# EAGLE design eCog_General_Template (EAGLE 6.6.0)
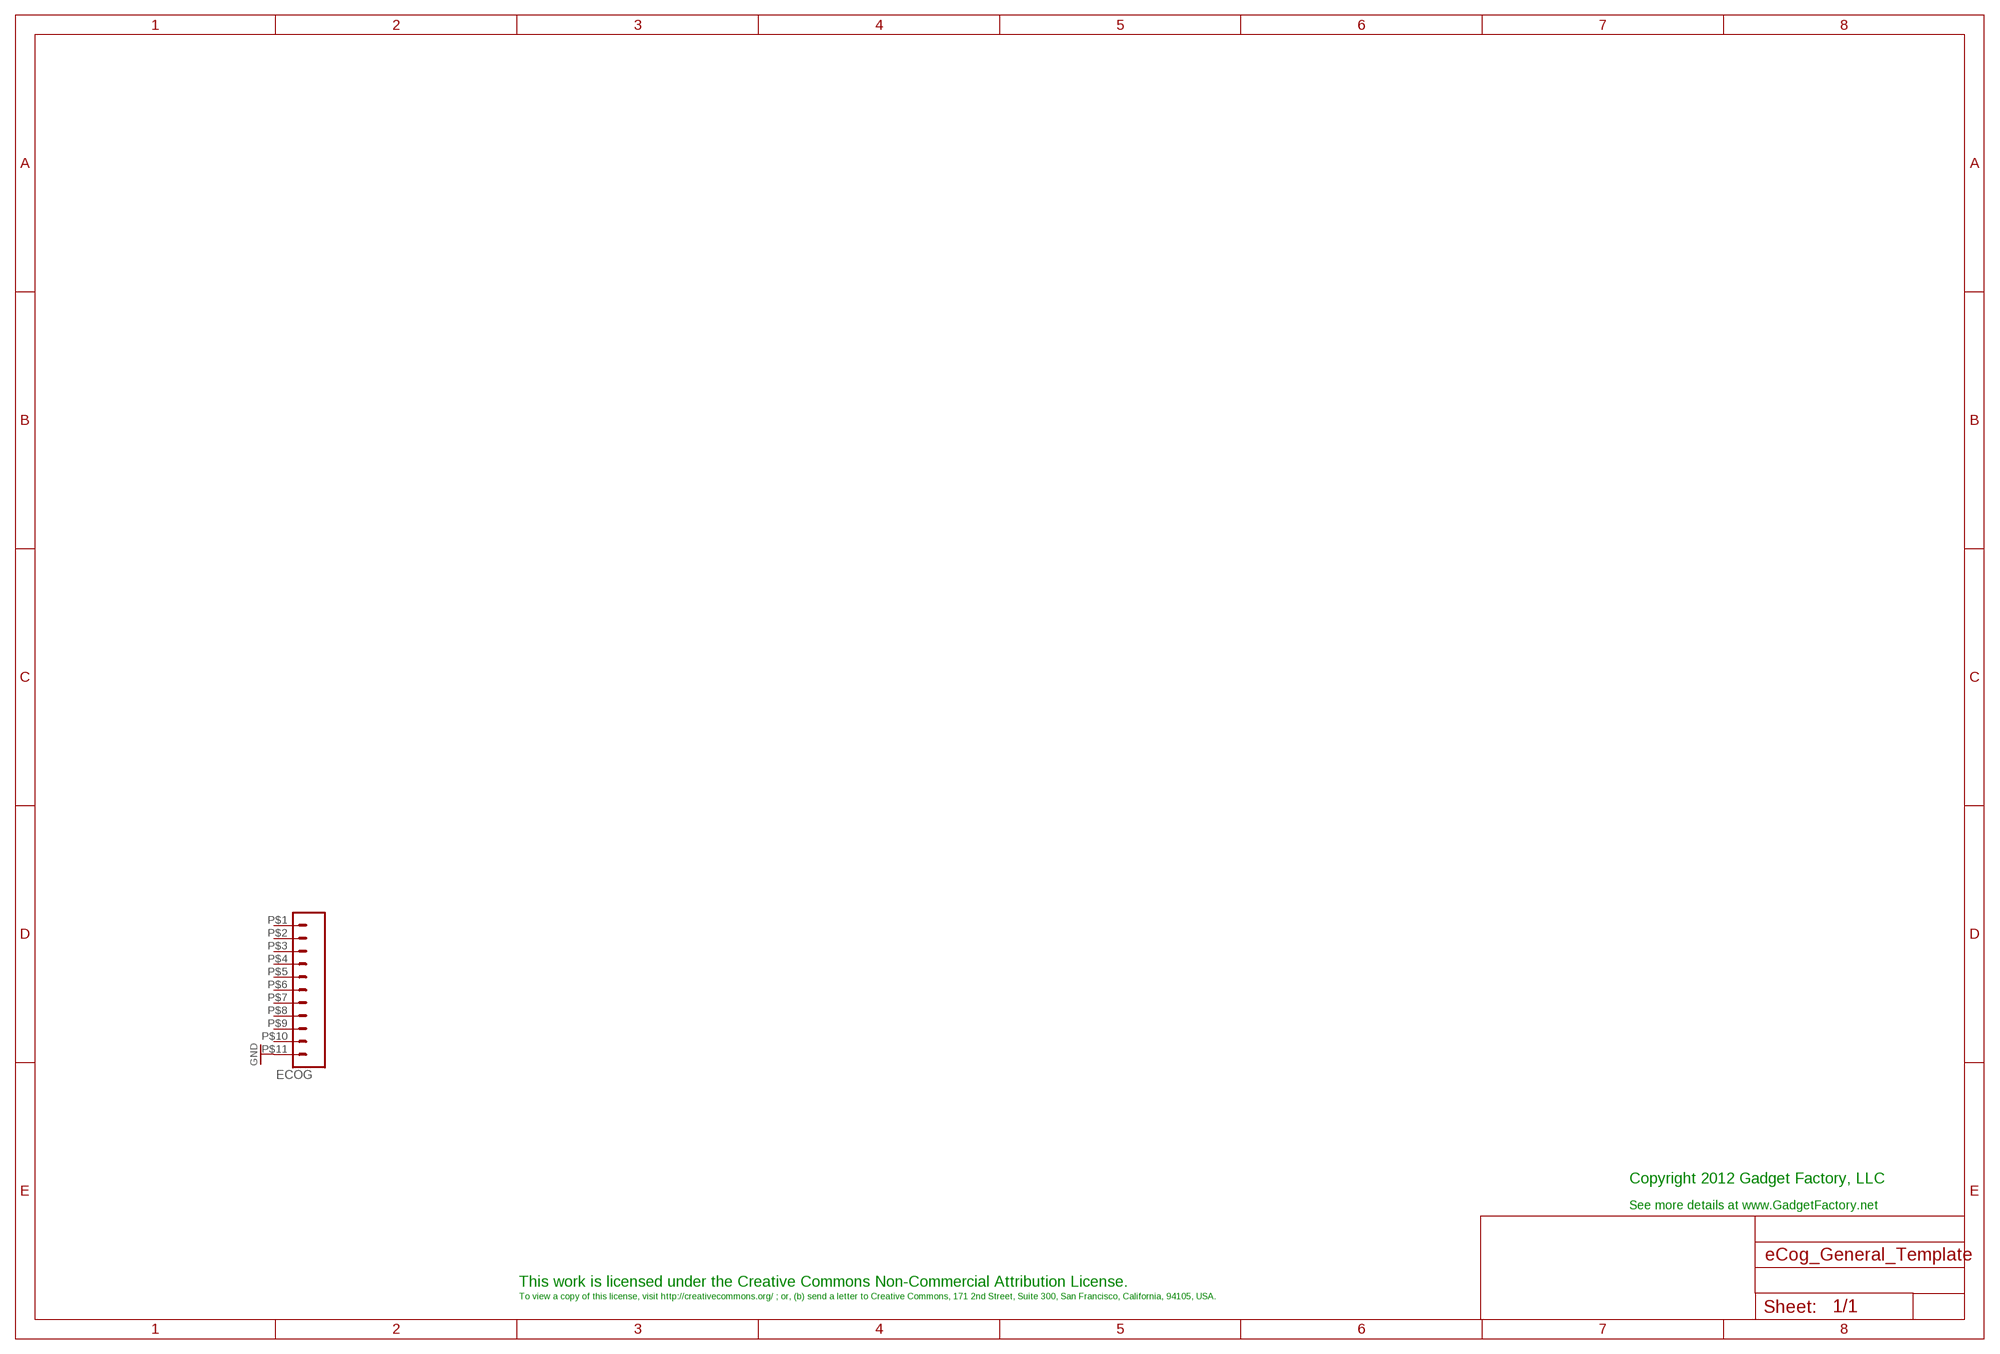
[diagram p0: schematic, sheet 1]

## Parts
ECOG  ECOG_GENERAL_ROWECOG_GENERAL_SMD  [ECOG_GENERAL_SMD]

## Nets
GND: ECOG.P$11(GND)
Unconnected: ECOG.P$1(G0) ECOG.P$2(G1) ECOG.P$3(G2) ECOG.P$4(G3) ECOG.P$5(G4) ECOG.P$6(G5) ECOG.P$7(G6) ECOG.P$8(5V) ECOG.P$9(3V3) ECOG.P$10(G7)

## Notes on the sheet
- Copyright 2012 Gadget Factory, LLC
- See more details at www.GadgetFactory.net
- This work is licensed under the Creative Commons Non-Commercial Attribution License.
- To view a copy of this license, visit http://creativecommons.org/ ; or, (b) send a letter to Creative Commons, 171 2nd Street, Suite 300, San Francisco, California, 94105, USA.

## Library data of the parts
ECOG = eCogs:ECOG_GENERAL_ROW

## Board
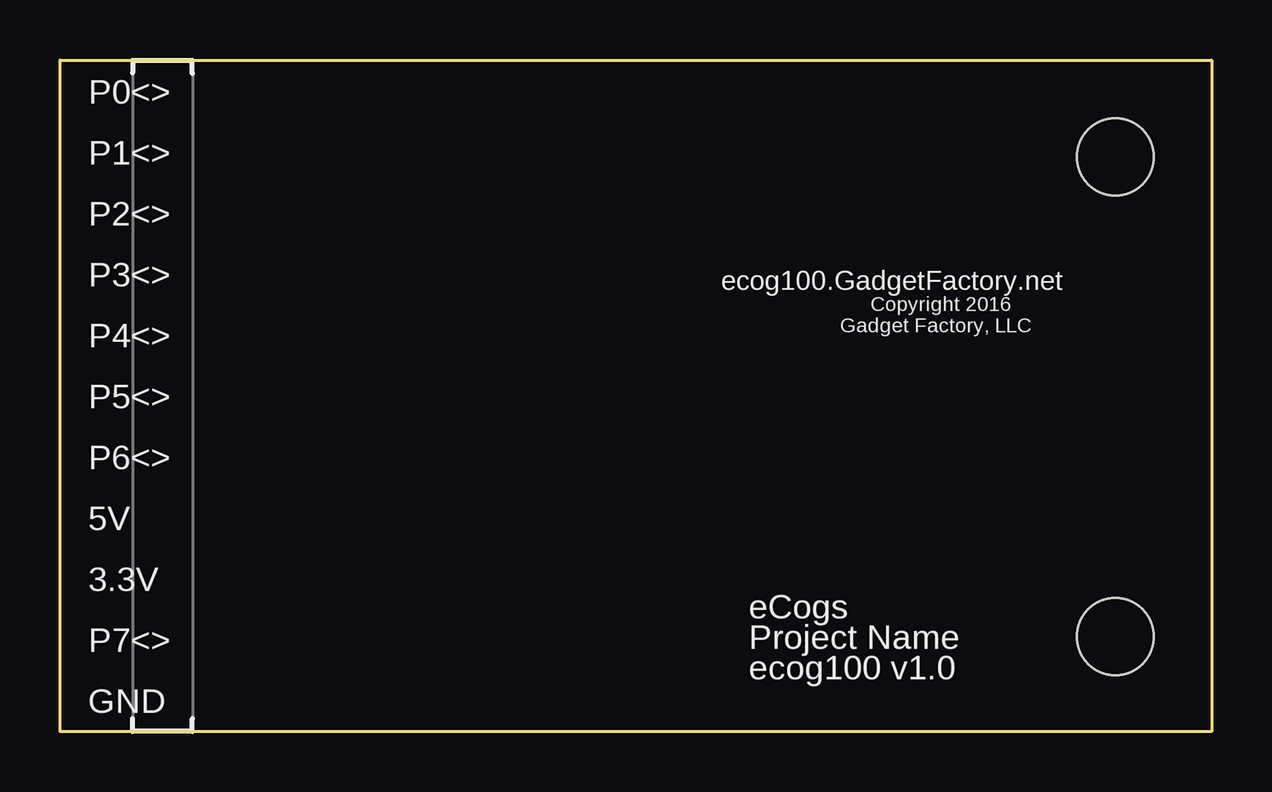
[diagram p1: board, top side]
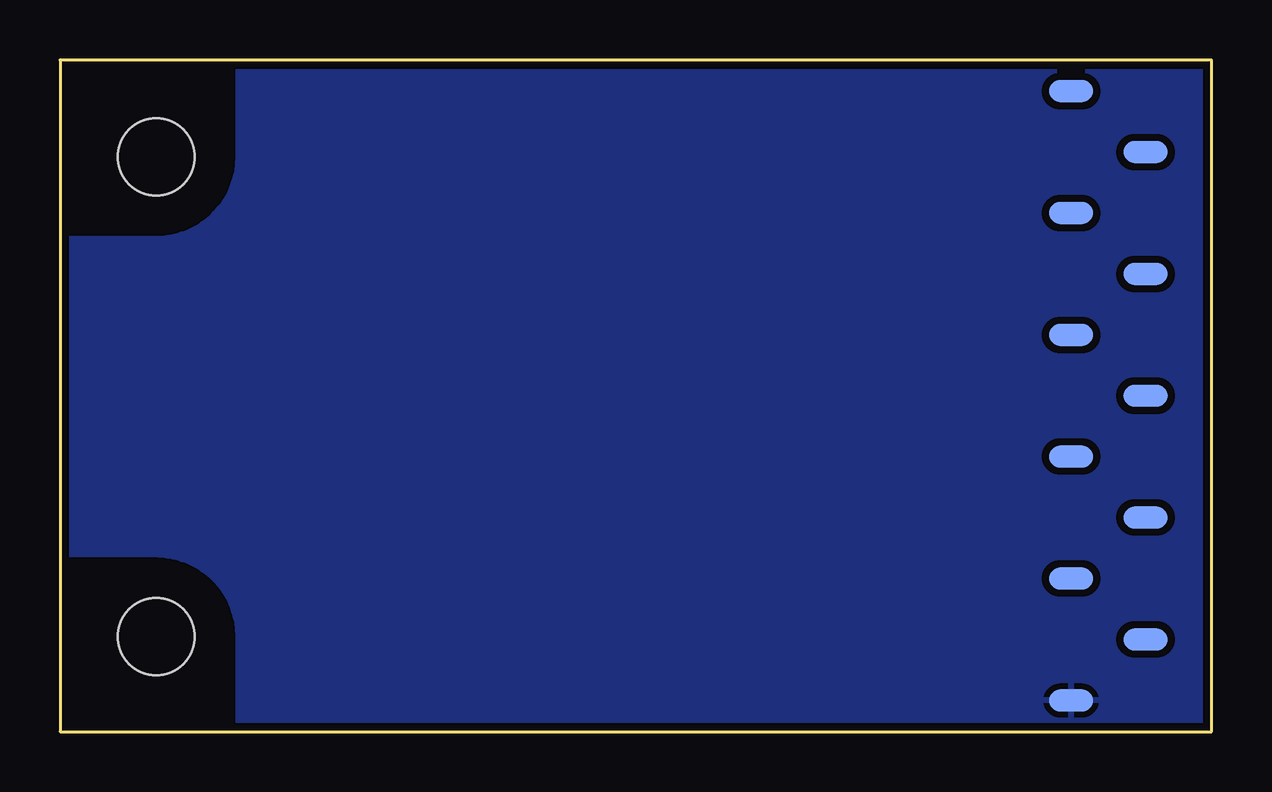
[diagram p2: board, bottom side, seen from below]

Size 48 x 28 mm. Coordinates in mm from the lower left corner, seen from the top.
Outline: 0,0 48,0 48,28 0,28 0,0
Copper layers (1*16): Top 0.035mm / dielectric 1.5mm / Bottom 0.035mm
Design rules "SparkFun": minimum track width 8mil, minimum drill 20mil, track to track 8mil, track to pad 8mil, pad to pad 8mil, via to via 8mil, smd to smd 8mil, copper to edge 10mil, drill to drill 8mil, minimum pad ring 12mil, minimum via ring 10mil, stop-mask expansion 4mil, vias tented up to drill 25mil, thermal gap 10mil

### Footprints (pad centres in the part's own frame; a part is rotated, then mirrored left to right if it is on the bottom)
ECOG_GENERAL_SMD = smd 1.841 x 0.914 bottom: P$1 5.849,26.7; P$2 2.751,24.16; P$3 5.849,21.62; P$4 2.751,19.08; P$5 5.849,16.54; P$6 2.751,14; P$7 5.849,11.46; P$8 2.751,8.92; P$9 5.849,6.38; P$10 2.751,3.84; P$11 5.849,1.3 | hole 3.2: 43.99,3.96; 43.99,23.96

### Placement (x,y rotation side)
ECOG  0,0 0 top

### Tracks (layer width: path | path; a pad name or v marks a point on that pad's centre or on a via)
GND
  pour Bottom (isolate 0.305): 0,28 48,28 48,0 0,0

### Text on the board
tPlace: P0<> | P1<> | P2<> | P3<> | ecog100.GadgetFactory.net | Copyright 2016 | Gadget Factory, LLC | P4<> | P5<> | P6<> | 5V | 3.3V | eCogs | P7<> | Project Name | ecog100 v1.0 | GND